# Altium schematic sheet 02_J-Link.SchDoc: =GlobalProjectName
size 594 x 420 mm; CheckedBy: A_D; Author: A_D; SheetNumber: 2; SheetTotal: 2; PageSetup: Record=PageOptions|CenterHorizontal=True|CenterVertical=True|PrintScale=0.70|XCorrection=1.00|YCorrection=1.00|PrintKind=2|BorderSize=5000000|LeftOffset=9000|BottomOffset=10100|Orientation=2|PaperLength=11176|PaperWidth=8636|Scale=100|PaperSource=259|PrintQuality=-3|MediaType=1|DitherType=10|PrintScaleMode=1|PaperKind=A3|PaperIndex=8
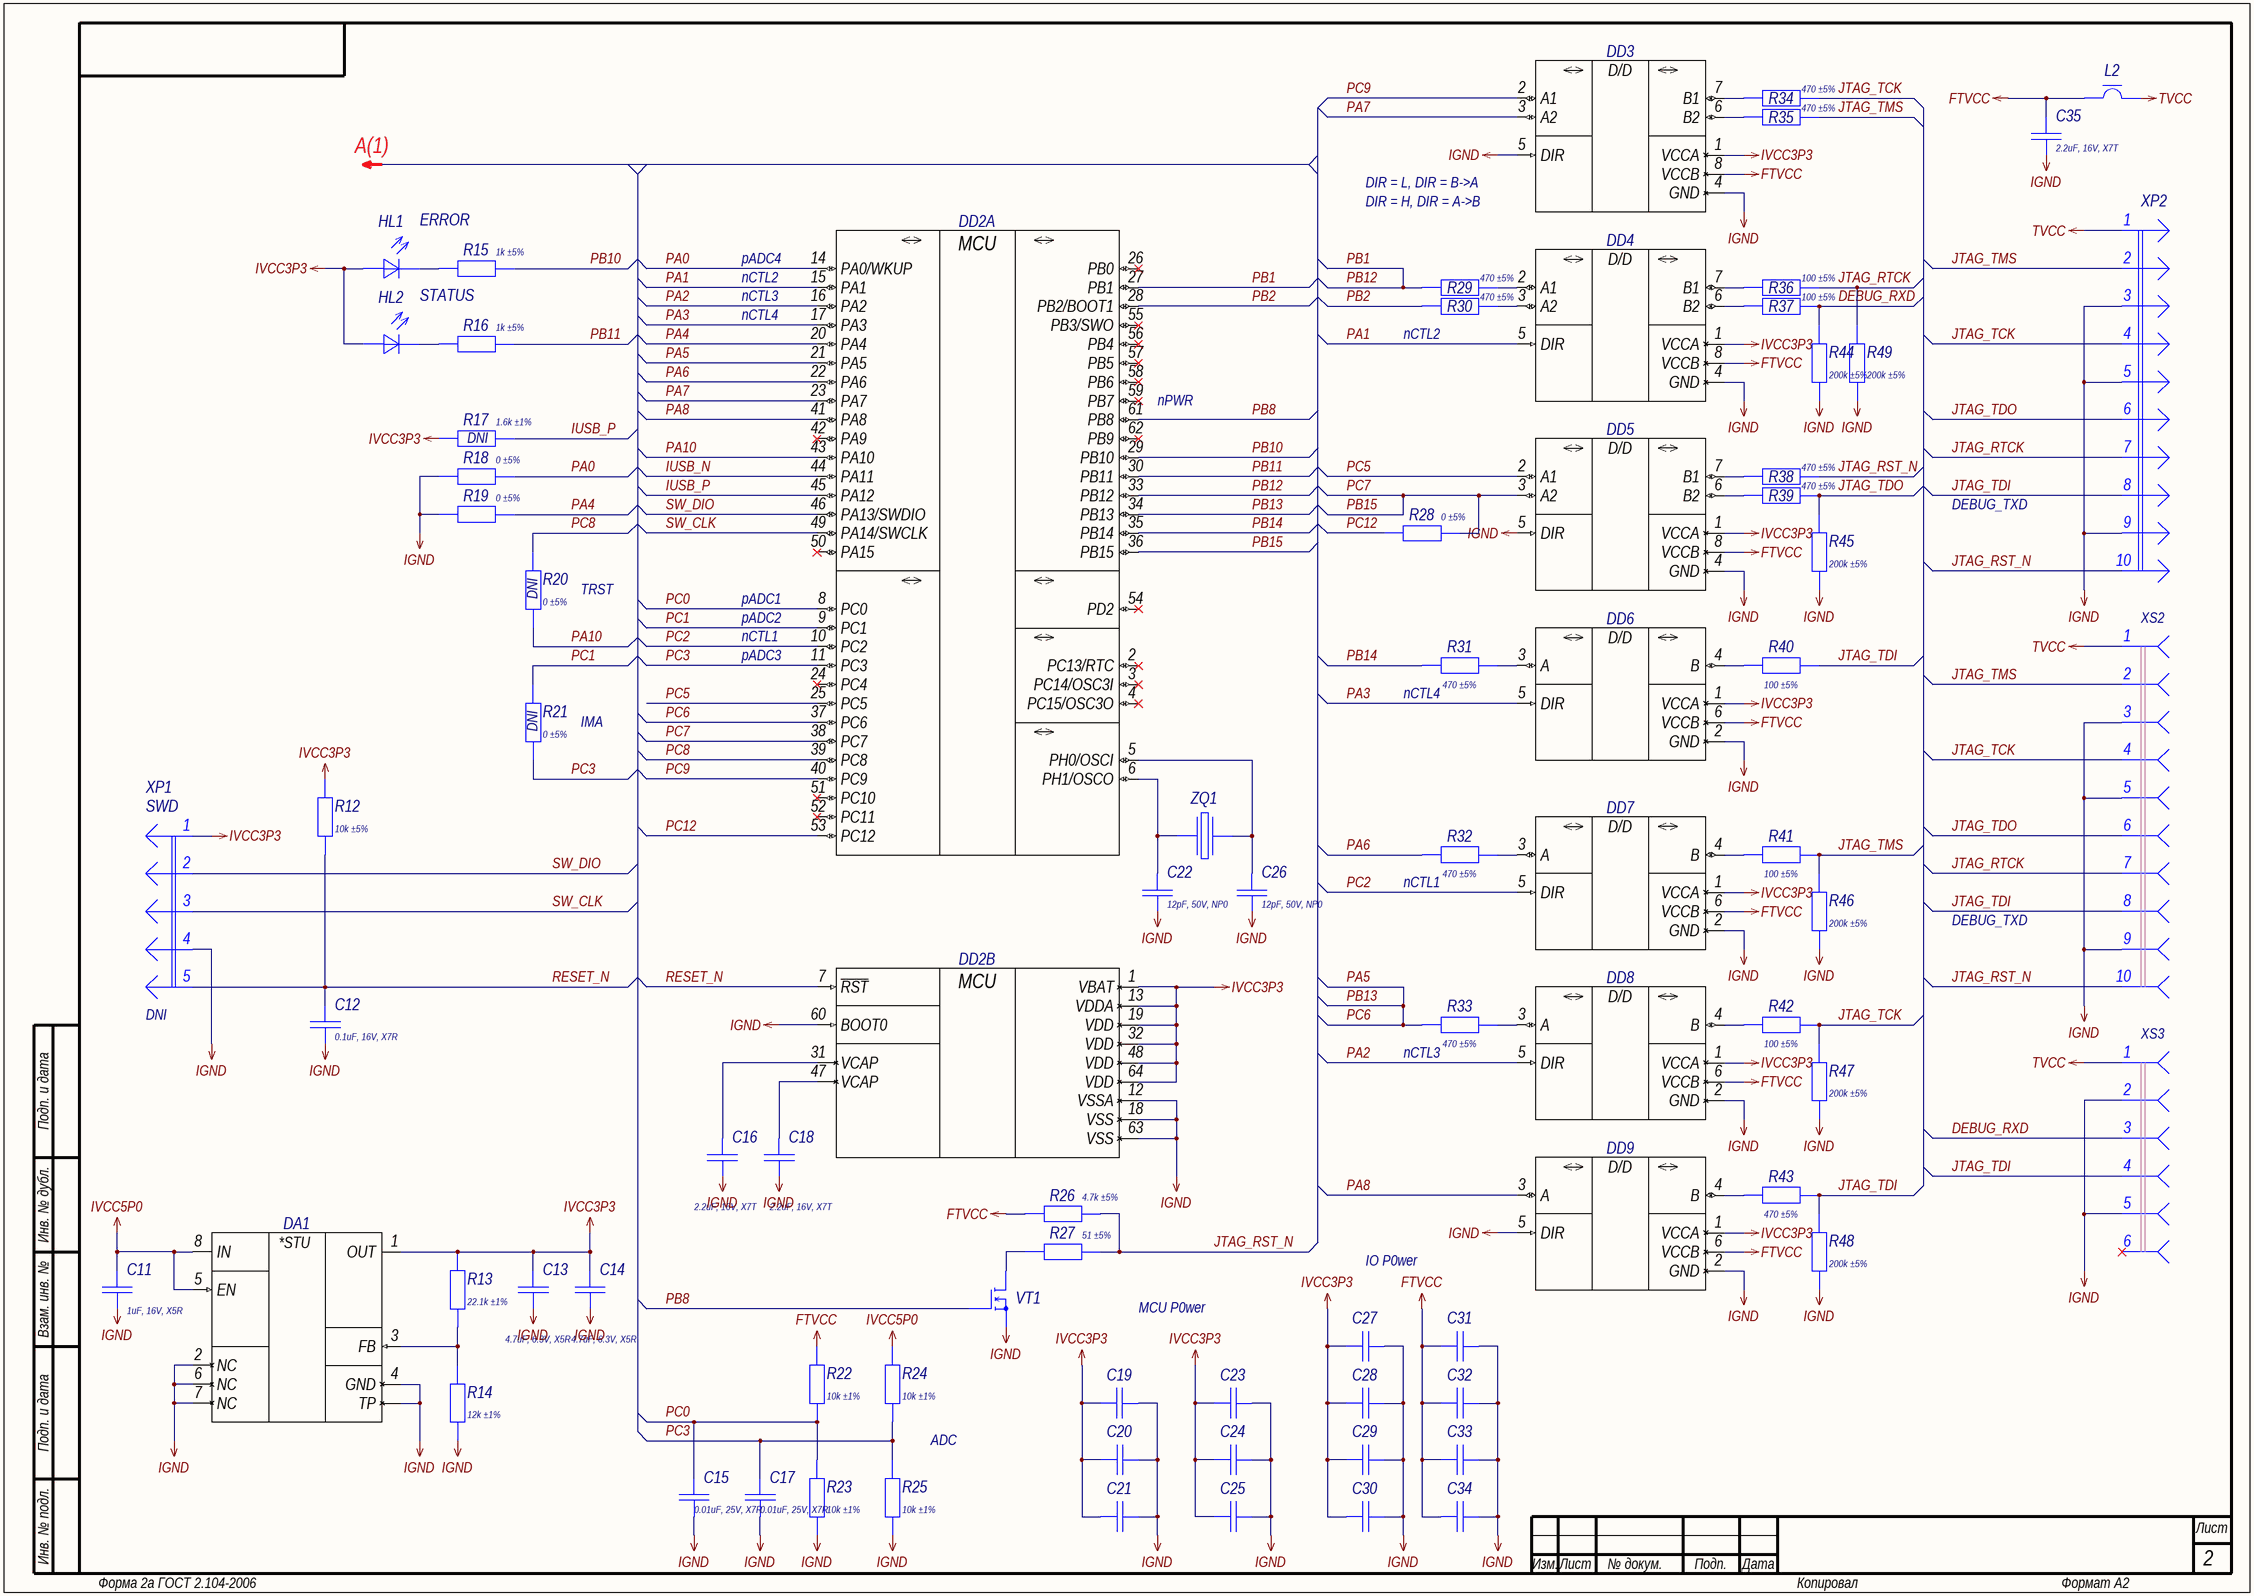
[diagram p0: 02_J-Link.SchDoc]

## Parts
C11  Schematic Value: 1uF, 16V, X5R  [C0402_L]  (hidden comment: Capacitor)
C12  Schematic Value: 0.1uF, 16V, X7R  [C0402_L]  (hidden comment: Capacitor)
C13  Schematic Value: 4.7uF, 6.3V, X5R  [C0402_L]  (hidden comment: Capacitor)
C14  Schematic Value: 4.7uF, 6.3V, X5R  [C0402_L]  (hidden comment: Capacitor)
C15  Schematic Value: 0.01uF, 25V, X7R  [C0402_L]  (hidden comment: Capacitor)
C16  Schematic Value: 2.2uF, 16V, X7T  [C0402_L]  (hidden comment: Capacitor)
C17  Schematic Value: 0.01uF, 25V, X7R  [C0402_L]  (hidden comment: Capacitor)
C18  Schematic Value: 2.2uF, 16V, X7T  [C0402_L]  (hidden comment: Capacitor)
C19  Capacitor  [C0402_L]  (value not drawn)
C20  Capacitor  [C0402_L]  (value not drawn)
C21  Capacitor  [C0402_L]  (value not drawn)
C22  Schematic Value: 12pF, 50V, NP0  [C0402_L]  (hidden comment: Capacitor)
C23  Capacitor  [C0402_L]  (value not drawn)
C24  Capacitor  [C0402_L]  (value not drawn)
C25  Capacitor  [C0402_L]  (value not drawn)
C26  Schematic Value: 12pF, 50V, NP0  [C0402_L]  (hidden comment: Capacitor)
C27  Capacitor  [C0402_L]  (value not drawn)
C28  Capacitor  [C0402_L]  (value not drawn)
C29  Capacitor  [C0402_L]  (value not drawn)
C30  Capacitor  [C0402_L]  (value not drawn)
C31  Capacitor  [C0402_L]  (value not drawn)
C32  Capacitor  [C0402_L]  (value not drawn)
C33  Capacitor  [C0402_L]  (value not drawn)
C34  Capacitor  [C0402_L]  (value not drawn)
C35  Schematic Value: 2.2uF, 16V, X7T  [C0402_L]  (hidden comment: Capacitor)
DA1  TPS73701DRB  [VSON-8_065P300X300X100_N]  (value not drawn)
DD2  STM32F205RxTx-Series  [LQFP-64_050P1000X1000X160_N]  (value not drawn)  (parts A,B of 2)
DD3  SN74LVC2T45DCx-Series  [VSSOP-8_050P200X230X090_N]  (value not drawn)
DD4  SN74LVC2T45DCx-Series  [VSSOP-8_050P200X230X090_N]  (value not drawn)
DD5  SN74LVC2T45DCx-Series  [VSSOP-8_050P200X230X090_N]  (value not drawn)
DD6  74LVC1T45x-Series  [X2-DFN-6_050P140X100X040_N]  (value not drawn)
DD7  74LVC1T45x-Series  [X2-DFN-6_050P140X100X040_N]  (value not drawn)
DD8  74LVC1T45x-Series  [X2-DFN-6_050P140X100X040_N]  (value not drawn)
DD9  74LVC1T45x-Series  [X2-DFN-6_050P140X100X040_N]  (value not drawn)
HL1  ERROR  [LD0402_L]
HL2  STATUS  [LD0402_L]
L2  FerriteBead  [L0402_L]  (value not drawn)
R12  Schematic Value: 10k ±5%  [R0402_L]  (hidden comment: Resistor)
R13  Schematic Value: 22.1k ±1%  [R0402_L]  (hidden comment: Resistor)
R14  Schematic Value: 12k ±1%  [R0402_L]  (hidden comment: Resistor)
R15  Schematic Value: 1k ±5%  [R0402_L]  (hidden comment: Resistor)
R16  Schematic Value: 1k ±5%  [R0402_L]  (hidden comment: Resistor)
R17  Schematic Value: 1.6k ±1%  [R0402_L]  (hidden comment: Resistor)  (no BOM)
R18  Schematic Value: 0 ±5%  [R0402_L]  (hidden comment: Resistor)
R19  Schematic Value: 0 ±5%  [R0402_L]  (hidden comment: Resistor)
R20  Schematic Value: 0 ±5%  [R0402_L]  (hidden comment: Resistor)  (no BOM)
R21  Schematic Value: 0 ±5%  [R0402_L]  (hidden comment: Resistor)  (no BOM)
R22  Schematic Value: 10k ±1%  [R0402_L]  (hidden comment: Resistor)
R23  Schematic Value: 10k ±1%  [R0402_L]  (hidden comment: Resistor)
R24  Schematic Value: 10k ±1%  [R0402_L]  (hidden comment: Resistor)
R25  Schematic Value: 10k ±1%  [R0402_L]  (hidden comment: Resistor)
R26  Schematic Value: 4.7k ±5%  [R0402_L]  (hidden comment: Resistor)
R27  Schematic Value: 51 ±5%  [R0402_L]  (hidden comment: Resistor)
R28  Schematic Value: 0 ±5%  [R0402_L]  (hidden comment: Resistor)
R29  Schematic Value: 470 ±5%  [R0402_L]  (hidden comment: Resistor)
R30  Schematic Value: 470 ±5%  [R0402_L]  (hidden comment: Resistor)
R31  Schematic Value: 470 ±5%  [R0402_L]  (hidden comment: Resistor)
R32  Schematic Value: 470 ±5%  [R0402_L]  (hidden comment: Resistor)
R33  Schematic Value: 470 ±5%  [R0402_L]  (hidden comment: Resistor)
R34  Schematic Value: 470 ±5%  [R0402_L]  (hidden comment: Resistor)
R35  Schematic Value: 470 ±5%  [R0402_L]  (hidden comment: Resistor)
R36  Schematic Value: 100 ±5%  [R0402_L]  (hidden comment: Resistor)
R37  Schematic Value: 100 ±5%  [R0402_L]  (hidden comment: Resistor)
R38  Schematic Value: 470 ±5%  [R0402_L]  (hidden comment: Resistor)
R39  Schematic Value: 470 ±5%  [R0402_L]  (hidden comment: Resistor)
R40  Schematic Value: 100 ±5%  [R0402_L]  (hidden comment: Resistor)
R41  Schematic Value: 100 ±5%  [R0402_L]  (hidden comment: Resistor)
R42  Schematic Value: 100 ±5%  [R0402_L]  (hidden comment: Resistor)
R43  Schematic Value: 470 ±5%  [R0402_L]  (hidden comment: Resistor)
R44  Schematic Value: 200k ±5%  [R0402_L]  (hidden comment: Resistor)
R45  Schematic Value: 200k ±5%  [R0402_L]  (hidden comment: Resistor)
R46  Schematic Value: 200k ±5%  [R0402_L]  (hidden comment: Resistor)
R47  Schematic Value: 200k ±5%  [R0402_L]  (hidden comment: Resistor)
R48  Schematic Value: 200k ±5%  [R0402_L]  (hidden comment: Resistor)
R49  Schematic Value: 200k ±5%  [R0402_L]  (hidden comment: Resistor)
VT1  MOSFET-N_32  [SOT-883B_035P060X100X040_N]  (value not drawn)
XP1  SWD  [PLS-5]  (no BOM)
XP2  JTAG  [IDC-10MR]  (value not drawn)
XS2  JTAG-FFC  [XF2M-1015-1A]  (value not drawn)  (parts A,B,C,D,E,F,G,H,I,J of 10)
XS3  DEBUG-FFC  [XF2M-0615-1A]  (value not drawn)  (parts A,B,C,D,E,F of 6)
ZQ1  Crystal  [SMD 5x3.2mm]  (value not drawn)

## Nets
FTVCC: C31.1 C32.1 C33.1 C34.1 C35.2 DD3.8(VCCB) DD4.8(VCCB) DD5.8(VCCB) DD6.6(VCCB) DD7.6(VCCB) DD8.6(VCCB) DD9.6(VCCB) L2.1 R22.2 R26.1
IGND: C11.1 C12.2 C13.1 C14.1 C15.2 C16.1 C17.2 C18.1 C19.1 C20.2 C21.2 C22.1 C23.2 C24.2 C25.2 C26.1 C27.2 C28.2 C29.2 C30.2 C31.2 C32.2 C33.2 C34.2 C35.1 DA1.2(NC) DA1.4(GND) DA1.6(NC) DA1.7(NC) DA1.TP DD2.12(VSSA) DD2.18(VSS) DD2.60(BOOT0) DD2.63(VSS) DD3.4(GND) DD3.5(DIR) DD4.4(GND) DD5.4(GND) DD5.5(DIR) DD6.2(GND) DD7.2(GND) DD8.2(GND) DD9.2(GND) DD9.5(DIR) R14.1 R18.1 R19.1 R23.1 R25.1 R44.1 R45.1 R46.1 R47.1 R48.1 R49.1 VT1.2(S) XP1.4 XP2.3 XP2.5 XP2.9 XS2.3 XS2.5 XS2.9 XS3.2 XS3.5
IVCC3P3: C13.2 C14.2 C19.2 C20.1 C21.1 C23.1 C24.1 C25.1 C27.1 C28.1 C29.1 C30.1 DA1.1(OUT) DD2.1(VBAT) DD2.13(VDDA) DD2.19(VDD) DD2.32(VDD) DD2.48(VDD) DD2.64(VDD) DD3.1(VCCA) DD4.1(VCCA) DD5.1(VCCA) DD6.1(VCCA) DD7.1(VCCA) DD8.1(VCCA) DD9.1(VCCA) HL1.1(А) HL2.1(А) R12.2 R13.2 R17.1 XP1.1
IVCC5P0: C11.2 DA1.5(EN) DA1.8(IN) R24.2
TVCC: L2.2 XP2.1 XS2.1 XS3.1
DEBUG_RXD: R37.2 R44.2 XS3.3
IUSB_N: DD2.44(PA11)
IUSB_P: DD2.45(PA12) R17.2
JTAG_RST_N: R26.2 R27.2 R38.2 XP2.10 XS2.10
JTAG_RTCK: R36.2 R49.2 XP2.7 XS2.7
JTAG_TCK: R34.2 R42.2 R47.2 XP2.4 XS2.4
JTAG_TDI: R40.2 R43.2 R48.2 XP2.8 XS2.8 XS3.4
JTAG_TDO: R39.2 R45.2 XP2.6 XS2.6
JTAG_TMS: R35.2 R41.2 R46.2 XP2.2 XS2.2
PA0: DD2.14(PA0/WKUP) R18.2
PA1: DD2.15(PA1) DD4.5(DIR)
PA2: DD2.16(PA2) DD8.5(DIR)
PA3: DD2.17(PA3) DD6.5(DIR)
PA4: DD2.20(PA4) R19.2
PA5: DD2.21(PA5) DD2.34(PB13) DD2.37(PC6) R33.1  [also labelled PB13, PC6]
PA6: DD2.22(PA6) R32.1
PA7: DD2.23(PA7) DD3.3(A2)
PA8: DD2.41(PA8) DD9.3(A)
PA10: DD2.43(PA10) R20.1
PB1: DD2.27(PB1) DD2.33(PB12) R29.1  [also labelled PB12]
PB2: DD2.28(PB2/BOOT1) R30.1
PB8: DD2.61(PB8) VT1.1(G)
PB10: DD2.29(PB10) R15.2
PB11: DD2.30(PB11) R16.2
PB14: DD2.35(PB14) R31.1
PB15: DD2.36(PB15) DD2.38(PC7) DD5.3(A2) R28.2  [also labelled PC7]
PC0: C15.1 DD2.8(PC0) R22.1 R23.2
PC1: DD2.9(PC1) R21.2
PC2: DD2.10(PC2) DD7.5(DIR)
PC3: C17.1 DD2.11(PC3) R21.1 R24.1 R25.2
PC5: DD2.25(PC5) DD5.2(A1)
PC8: DD2.39(PC8) R20.2
PC9: DD2.40(PC9) DD3.2(A1)
PC12: DD2.53(PC12) R28.1
RESET_N: C12.1 DD2.7(~{RST}) R12.1 XP1.5
SW_CLK: DD2.49(PA14/SWCLK) XP1.3
SW_DIO: DD2.46(PA13/SWDIO) XP1.2
NetC16_2: C16.2 DD2.31(VCAP)
NetC18_2: C18.2 DD2.47(VCAP)
NetC22_2: C22.2 DD2.6(PH1/OSCO) ZQ1.1
NetC26_2: C26.2 DD2.5(PH0/OSCI) ZQ1.3
NetDA1_3: DA1.3(FB) R13.1 R14.2
NetDD3_6: DD3.6(B2) R35.1
NetDD3_7: DD3.7(B1) R34.1
NetDD4_2: DD4.2(A1) R29.2
NetDD4_3: DD4.3(A2) R30.2
NetDD4_6: DD4.6(B2) R37.1
NetDD4_7: DD4.7(B1) R36.1
NetDD5_6: DD5.6(B2) R39.1
NetDD5_7: DD5.7(B1) R38.1
NetDD6_3: DD6.3(A) R31.2
NetDD6_4: DD6.4(B) R40.1
NetDD7_3: DD7.3(A) R32.2
NetDD7_4: DD7.4(B) R41.1
NetDD8_3: DD8.3(A) R33.2
NetDD8_4: DD8.4(B) R42.1
NetDD9_4: DD9.4(B) R43.1
NetHL1_2: HL1.2(К) R15.1
NetHL2_2: HL2.2(К) R16.1
NetR27_1: R27.1 VT1.3(D)

Not connected (* = marked no-connect by the designer): DD2 2(PC13/RTC)* 3(PC14/OSC3I)* 4(PC15/OSC3O)* 24(PC4)* 26(PB0)* 42(PA9)* 50(PA15)* 51(PC10)* 52(PC11)* 54(PD2)* 55(PB3/SWO)* 56(PB4)* 57(PB5)* 58(PB6)* 59(PB7)* 62(PB9)*; XS3 6*

## Notes on the sheet
- А(1)
- (near DD3) DIR = L, DIR = B->A
- (near DD3) DIR = H, DIR = A->B
- pADC4
- nCTL3
- nCTL2
- nCTL4
- (near R30) nCTL2
- (near DD2) nPWR
- (near R17) DNI
- DEBUG_TXD
- (near R20) DNI
- TRST
- nCTL1
- pADC1
- pADC2
- (near XS2) XS2
- pADC3
- (near R31) nCTL4
- (near R21) DNI
- IMA
- (near R32) nCTL1
- (near XP1) DNI
- (near R33) nCTL3
- (near XS3) XS3
- IO P0wer
- MCU P0wer
- ADC
- Подп. и дата
- Инв. № дубл.
- Взам. инв. №
- Инв. № подл.
- Изм.
- Лист
- № докум.
- Подп.
- Дата
- Форма 2а ГОСТ 2.104-2006
- Копировал
- Формат А2
- (in symbol 74LVC1T45FZ4-7) D/D
- (in symbol SN74LVC2T45DCUR) D/D
- (in symbol STM32F205RET6, part A) MCU
- (in symbol STM32F205RET6, part B) MCU
- (in symbol TPS73701DRBR) *STU

## Library data of the parts
C11 = GRM155R61C105KA12D: Manufacturer: Murata; Type: Конденсатор; ID: 272; Value: 1uF; Voltage: 16V; Tolerance: ±10%; Dielectric Type: X5R; Application Category: 1; Working Temperature Min: -55°С; Working Temperature Max: +85°С; Published: 18.05.2010; Publisher: Andrew Danich; Part Number: GRM155R61C105KA12D; Footprint: 0402; ClassName: DirectConnect
C12 = GCM155R71C104KA55D: Manufacturer: Murata; Type: Конденсатор; ID: 163; Value: 0.1uF; Voltage: 16V; Tolerance: ±10%; Dielectric Type: X7R; Application Category: 1; Working Temperature Min: -55°С; Working Temperature Max: +125°С; Functional Analog: GRM155R71C104KA88D; Published: 18.05.2010; Publisher: Andrew Danich; Part Number: GCM155R71C104KA55D; Footprint: 0402
C13 C14 = GRM155R60J475ME87D: Manufacturer: Murata; Type: Конденсатор; ID: 223; Value: 4.7uF; Voltage: 6.3V; Tolerance: ±20%; Dielectric Type: X5R; Application Category: 1; Working Temperature Min: -55°С; Working Temperature Max: +85°С; Published: 18.05.2010; Publisher: Andrew Danich; Part Number: GRM155R60J475ME87D; Footprint: 0402; ClassName: DirectConnect
C15 C17 = GCM155R71E103KA37D: Manufacturer: Murata; Type: Конденсатор; ID: 150; Value: 0.01uF; Voltage: 25V; Tolerance: ±10%; Dielectric Type: X7R; Application Category: 1; Working Temperature Min: -55°С; Working Temperature Max: +125°С; Functional Analog: GRM155R71E103KA01D; Published: 18.05.2010; Publisher: Andrew Danich; Part Number: GCM155R71E103KA37D; Footprint: 0402
C16 C18 C35 = GRM155D71C225ME11D: Manufacturer: Murata; Type: Конденсатор; ID: 180; Value: 2.2uF; Voltage: 16V; Tolerance: ±20%; Dielectric Type: X7T; Application Category: 1; Working Temperature Min: -55°С; Working Temperature Max: +125°С; Functional Analog: GRM155R60J225ME15D; Published: 18.05.2010; Publisher: Andrew Danich; Part Number: GRM155D71C225ME11D; Footprint: 0402; ClassName: DirectConnect
C19 = GRM155R60J475ME87D: Manufacturer: Murata; Type: Конденсатор; ID: 223; Value: 4.7uF; Voltage: 6.3V; Tolerance: ±20%; Dielectric Type: X5R; Application Category: 1; Working Temperature Min: -55°С; Working Temperature Max: +85°С; Schematic Value: 4.7uF, 6.3V, X5R; Published: 18.05.2010; Publisher: Andrew Danich; Part Number: GRM155R60J475ME87D; Footprint: 0402; ClassName: DirectConnect
C20 C21 C23-C25 C27-C34 = GCM155R71C104KA55D: Manufacturer: Murata; Type: Конденсатор; ID: 163; Value: 0.1uF; Voltage: 16V; Tolerance: ±10%; Dielectric Type: X7R; Application Category: 1; Working Temperature Min: -55°С; Working Temperature Max: +125°С; Functional Analog: GRM155R71C104KA88D; Schematic Value: 0.1uF, 16V, X7R; Published: 18.05.2010; Publisher: Andrew Danich; Part Number: GCM155R71C104KA55D; Footprint: 0402; ClassName: DirectConnect
C22 C26 = GRM1555C1H120JA01D: Manufacturer: Murata; Type: Конденсатор; ID: 159; Value: 12pF; Voltage: 50V; Tolerance: ±5%; Dielectric Type: NP0; Application Category: 1; Published: 18.05.2010; Publisher: Andrew Danich; Part Number: GRM1555C1H120JA01D; Footprint: 0402; ClassName: DirectConnect
DA1 = TPS73701DRBR: Manufacturer: Texas Instruments; ID: 26; Input Voltage: +2.2…5.5V; Output Current: 1A; Output Voltage: +1.2…5.5V; Application Category: 1; Working Temperature Min: -40°С; Working Temperature Max: +125°С; Functional Analog: TPS73701DRBT; Published: 25.03.2019; Publisher: Andrew Danich; Type: Микросхема; Part Number: TPS73701DRBR; Value: TPS73701DRBR; ClassName: DirectConnect
DD2 = STM32F205RET6: Manufacturer: STMicroelectronics; ID: 33; Supply Operation: +1.8…3.6V; Flash: 512K; SRAM: 128K; Prog Interface: JTAG, SWD, UART; I/O Lines: 51; Operation Frequency: 120MHz; Application Category: 1; Working Temperature Min: -40°С; Working Temperature Max: +85°С; Published: 16.10.2015; Publisher: Andrew Danich; Type: Микросхема; Part Number: STM32F205RET6; Value: STM32F205RET6; EEPROM: -
DD3-DD5 = SN74LVC2T45DCUR: Manufacturer: Texas Instruments; ID: 18; Supply 1 Operation: +1,65…5,5V; Supply Current: 10uA; Directional: Unidirection; Channels: 2; Max Data Rate: 420Mbps; Application Category: 1; Working Temperature Min: -40°С; Working Temperature Max: +85°С; Functional Analog: 74LVCH2T45DC,125; Published: 06.03.2020; Publisher: Andrew Danich; Type: Микросхема; Part Number: SN74LVC2T45DCUR; Value: SN74LVC2T45DCUR; Supply 2 Operation: +1,65…5,5V
DD6-DD9 = 74LVC1T45FZ4-7: Manufacturer: Diodes Incorporated; ID: 13; Supply 1 Operation: +1.65…5.5V; Supply Current: 3uA; Directional: Bidirection; Channels: 1; Prop Delay: 15.1nS; Working Temperature Min: -40°С; Working Temperature Max: +150°С; Published: 17.07.2019; Publisher: Andrew Danich; Type: Микросхема; Part Number: 74LVC1T45FZ4-7; Value: 74LVC1T45FZ4-7; Supply 2 Operation: +1.65…5.5V; Application Category: 1
HL1 = KPHHS-1005SURCK: Manufacturer: Kingbright; Type: Индикатор единичный; ID: 35; Forward Voltage: 2.5V; Forward Current: 20mA; Power Dissipation: 75mW; Luminous Flux: 140; Color: Red; Leds: 1; Working Temperature Min: -40°С; Working Temperature Max: +85°С; Published: 03.12.2013; Publisher: Andrew Danich; Part Number: KPHHS-1005SURCK; Value: KPHHS-1005SURCK; Footprint: 0402; Application Category: 1
HL2 = KPHHS-1005QBC-D-V: Manufacturer: Kingbright; Type: Индикатор единичный; ID: 24; Forward Voltage: 3.3V; Forward Current: 20mA; Power Dissipation: 120mW; Luminous Flux: 60; Color: Blue; Leds: 1; Working Temperature Min: -40°С; Working Temperature Max: +85°С; Published: 03.12.2013; Publisher: Andrew Danich; Part Number: KPHHS-1005QBC-D-V; Value: KPHHS-1005QBC-D-V; Footprint: 0402; Application Category: 1
L2 = BLM15PD121SN1D: Manufacturer: Murata; Type: Дроссель; ID: 11; Rated Current: 1.3A; Impedance at 100Mhz: 120ohm; Tolerance: ±25%; DC Resistance: 0.09ohm; Inductor Type: EMIFIL; Application Category: 1; Working Temperature Min: -55°С; Working Temperature Max: +125°С; Published: 14.11.2014; Publisher: Andrew Danich; Part Number: BLM15PD121SN1D; Value: BLM15PD121SN1D; Footprint: 0402; ClassName: DirectConnect
R12 = RC0402JR-0710KL: Manufacturer: Yageo; ID: 476; Value: 10k; Limit Voltage: 50V; Tolerance: ±5%; Temperature Coefficient: 100ppm; Total Power Dissipation: 0.1W; Series Type: Thick-Film; Application Category: 1; Working Temperature Min: -55°С; Working Temperature Max: +155°С; Published: 24.03.2010; Publisher: Andrew Danich; Type: Резистор; Part Number: RC0402JR-0710KL; Footprint: 0402
R13 = RC0402FR-0722K1L: Manufacturer: Yageo; ID: 447; Value: 22.1k; Limit Voltage: 50V; Tolerance: ±1%; Temperature Coefficient: 100ppm; Total Power Dissipation: 0.1W; Series Type: Thick-Film; Application Category: 1; Working Temperature Min: -55°С; Working Temperature Max: +155°С; Published: 24.03.2010; Publisher: Andrew Danich; Type: Резистор; Part Number: RC0402FR-0722K1L; Footprint: 0402
R14 = RC0402FR-0712KL: Manufacturer: Yageo; ID: 318; Value: 12k; Limit Voltage: 50V; Tolerance: ±1%; Temperature Coefficient: 100ppm; Total Power Dissipation: 0.1W; Series Type: Thick-Film; Application Category: 1; Working Temperature Min: -55°С; Working Temperature Max: +155°С; Published: 24.03.2010; Publisher: Andrew Danich; Type: Резистор; Part Number: RC0402FR-0712KL; Footprint: 0402
R15 R16 = RC0402JR-071KL: Manufacturer: Yageo; ID: 3; Value: 1k; Limit Voltage: 50V; Tolerance: ±5%; Temperature Coefficient: 100ppm; Total Power Dissipation: 0.1W; Series Type: Thick-Film; Application Category: 1; Working Temperature Min: -55°С; Working Temperature Max: +155°С; Published: 24.03.2010; Publisher: Andrew Danich; Type: Резистор; Part Number: RC0402JR-071KL; Footprint: 0402
R17 = RC0402FR-071K6L: Manufacturer: Yageo; ID: 504; Value: 1.6k; Limit Voltage: 50V; Tolerance: ±1%; Temperature Coefficient: 100ppm; Total Power Dissipation: 0.1W; Series Type: Thick-Film; Application Category: 1; Working Temperature Min: -55°С; Working Temperature Max: +155°С; Published: 24.03.2010; Publisher: Andrew Danich; Type: Резистор; Part Number: RC0402FR-071K6L; Footprint: 0402
R18-R21 R28 = RC0402JR-070RL: Manufacturer: Yageo; ID: 362; Value: 0; Limit Voltage: 50V; Tolerance: ±5%; Temperature Coefficient: 100ppm; Total Power Dissipation: 0.1W; Series Type: Thick-Film; Application Category: 1; Working Temperature Min: -55°С; Working Temperature Max: +155°С; Published: 24.03.2010; Publisher: Andrew Danich; Type: Резистор; Part Number: RC0402JR-070RL; Footprint: 0402
R22-R25 = RC0402FR-0710KL: Manufacturer: Yageo; ID: 2; Value: 10k; Limit Voltage: 50V; Tolerance: ±1%; Temperature Coefficient: 100ppm; Total Power Dissipation: 0.1W; Series Type: Thick-Film; Application Category: 1; Working Temperature Min: -55°С; Working Temperature Max: +155°С; Published: 24.03.2010; Publisher: Andrew Danich; Type: Резистор; Part Number: RC0402FR-0710KL; Footprint: 0402
R26 = RC0402JR-074K7L: Manufacturer: Yageo; ID: 4; Value: 4.7k; Limit Voltage: 50V; Tolerance: ±5%; Temperature Coefficient: 100ppm; Total Power Dissipation: 0.1W; Series Type: Thick-Film; Application Category: 1; Working Temperature Min: -55°С; Working Temperature Max: +155°С; Published: 24.03.2010; Publisher: Andrew Danich; Type: Резистор; Part Number: RC0402JR-074K7L; Footprint: 0402
R27 = RC0402JR-0751RL: Manufacturer: Yageo; ID: 374; Value: 51; Limit Voltage: 50V; Tolerance: ±5%; Temperature Coefficient: 100ppm; Total Power Dissipation: 0.1W; Series Type: Thick-Film; Application Category: 1; Working Temperature Min: -55°С; Working Temperature Max: +155°С; Published: 24.03.2010; Publisher: Andrew Danich; Type: Резистор; Part Number: RC0402JR-0751RL; Footprint: 0402
R29-R35 R38 R39 R43 = RC0402JR-07470RL: Manufacturer: Yageo; ID: 619; Value: 470; Limit Voltage: 50V; Tolerance: ±5%; Temperature Coefficient: 100ppm; Total Power Dissipation: 0.1W; Series Type: Thick-Film; Application Category: 1; Working Temperature Min: -55°С; Working Temperature Max: +155°С; Published: 24.03.2010; Publisher: Andrew Danich; Type: Резистор; Part Number: RC0402JR-07470RL; Footprint: 0402
R36 R37 R40-R42 = RC0402JR-07100RL: Manufacturer: Yageo; ID: 479; Value: 100; Limit Voltage: 50V; Tolerance: ±5%; Temperature Coefficient: 100ppm; Total Power Dissipation: 0.1W; Series Type: Thick-Film; Application Category: 1; Working Temperature Min: -55°С; Working Temperature Max: +155°С; Published: 24.03.2010; Publisher: Andrew Danich; Type: Резистор; Part Number: RC0402JR-07100RL; Footprint: 0402
R44-R49 = RC0402JR-07200KL: Manufacturer: Yageo; ID: 353; Value: 200k; Limit Voltage: 50V; Tolerance: ±5%; Temperature Coefficient: 100ppm; Total Power Dissipation: 0.1W; Series Type: Thick-Film; Application Category: 1; Working Temperature Min: -55°С; Working Temperature Max: +155°С; Published: 24.03.2010; Publisher: Andrew Danich; Type: Резистор; Part Number: RC0402JR-07200KL; Footprint: 0402
VT1 = NX3008NBKMB: Manufacturer: NXP Semiconductors; Type: Транзистор; ID: 36; D-S Voltage: 30V; Drain Current: 530mA; D-S On-Resistance: 1.4omh; Gate Capacitance: 50pF; Total Power Dissipation: 360mW; Gate Threshold Voltage: 1.1V; Application Category: 1; Working Temperature Min: -55°С; Working Temperature Max: +150°С; Published: 24.09.2010; Publisher: Andrew Danich; Part Number: NX3008NBKMB; Value: NX3008NBKMB; Functional Analog: -
XP1 = PLS-5: Value: PLS-5; ID: 4; Limit Voltage: 250V; Limit Current: 3A; Connector Type: Male; Resistance: 15momh; Surface Finish: Gold; Pitch: 2.54mm; Application Category: 1; Published: 07.03.2013; Publisher: Andrew Danich; Type: Вилка; Part Number: PLS-5; Pins: 5
XP2 = IDC-10MR: ID: 11; Limit Voltage: 500V; Limit Current: 1A; Connector Type: Male; Resistance: 20mohm; Pitch: 2.54mm; Application Category: 1; Functional Analog: DS1013-10RSIB, C3510-10SPGB00; Value: IDC-10MR; Published: 07.03.2013; Publisher: Andrew Danich; Type: Вилка; Part Number: IDC-10MR; Pins: 10
XS2 = XF2M-1015-1A: Manufacturer: Omron Electronics; ID: 7; Limit Voltage: 50V; Limit Current: 500mA; Connector Type: Female; Resistance: 0.05ohm; Pitch: 0.5mm; Application Category: 1; Working Temperature Min: -30°С; Working Temperature Max: +85°С; Published: 07.09.2015; Publisher: Viktor Klishin; Type: Розетка; Part Number: XF2M-1015-1A; Value: XF2M-1015-1A; Pins: 10; Series: FPC
XS3 = XF2M-0615-1A: Manufacturer: Omron Electronics; ID: 6; Limit Voltage: 50V; Limit Current: 500mA; Connector Type: Female; Resistance: 0.05ohm; Pitch: 0.5mm; Application Category: 1; Working Temperature Min: -30°С; Working Temperature Max: +85°С; Published: 16.02.2017; Publisher: Viktor Klishin; Type: Розетка; Part Number: XF2M-0615-1A; Value: XF2M-0615-1A; Pins: 6; Series: FPC
ZQ1 = AB-12.000MALE-T: ID: 14; Output Frequency: 12MHz; Load Capacitance: 12pF; Application Category: 1; Published: 08.03.2013; Publisher: Andrew Danich; Type: Резонатор; Part Number: AB-12.000MALE-T; Value: AB-12.000MALE-T